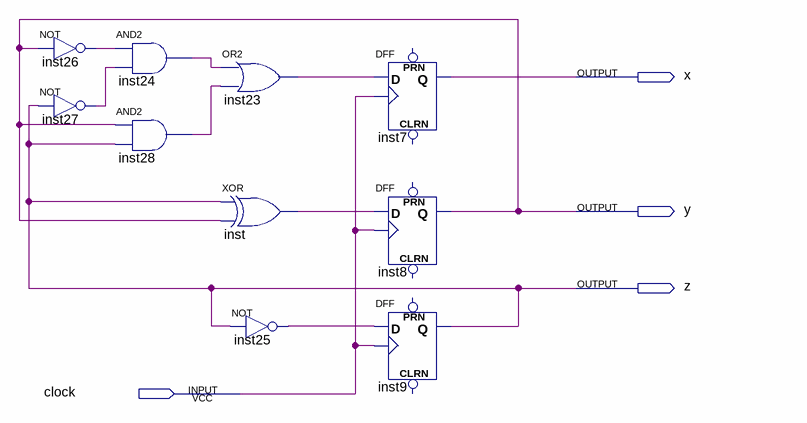
[diagram p0: schematic sheet]
// Quartus schematic count_25.bdf as structural Verilog: 10 symbols, 4 pins
module count_25 (
  input  clock,
  output x,
  output y,
  output z
);

  wire inst23_out, inst24_out, inst25_out, inst26_out, inst27_out, inst28_out, inst_out;

  not inst26 (inst26_out, y);
  not inst27 (inst27_out, z);
  and inst24 (inst24_out, inst26_out, inst27_out);
  and inst28 (inst28_out, y, z);
  or inst23 (inst23_out, inst24_out, inst28_out);
  xor inst (inst_out, z, y);
  not inst25 (inst25_out, z);
  DFF inst7 (.CLK(clock), .D(inst23_out), .Q(x));  // open: CLRN, PRN
  DFF inst8 (.CLK(clock), .D(inst_out), .Q(y));  // open: CLRN, PRN
  DFF inst9 (.CLK(clock), .D(inst25_out), .Q(z));  // open: CLRN, PRN
endmodule
